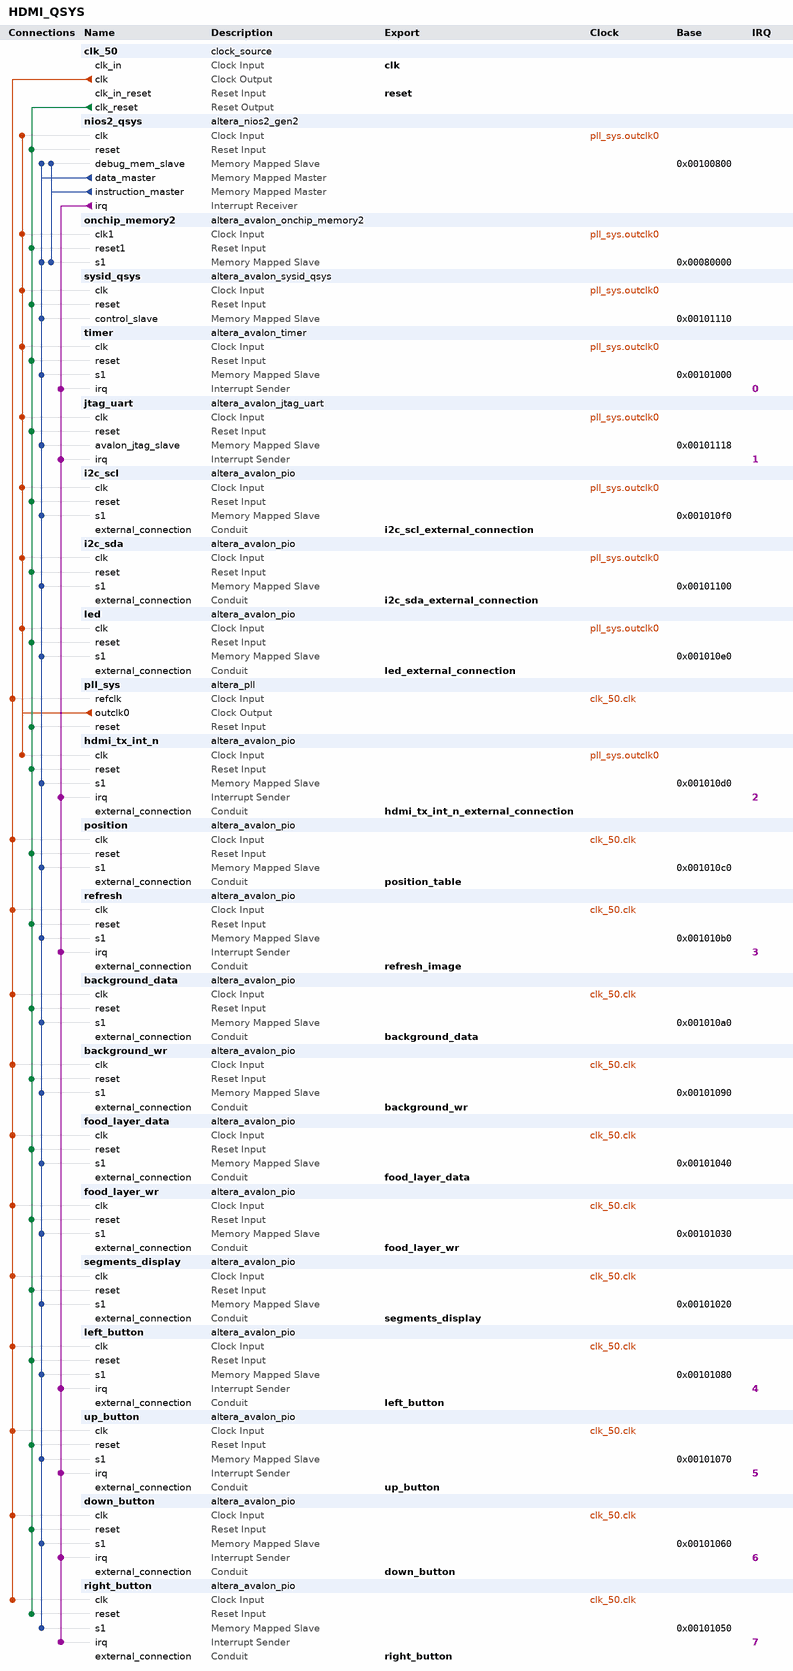
[diagram p0: system contents]
# Platform Designer (Qsys) system HDMI_QSYS, Cyclone V 5CGXFC5C6F27C7
# Parameters at their usual value, and those the tool derives, are not listed.
package require -exact qsys 18.0
create_system HDMI_QSYS
set_project_property DEVICE_FAMILY {Cyclone V}
set_project_property DEVICE 5CGXFC5C6F27C7

add_instance clk_50 clock_source 18.0
set_instance_parameter_value clk_50 clockFrequency 50000000

add_instance nios2_qsys altera_nios2_gen2 18.0
set_instance_parameter_value nios2_qsys dcache_size 2048
set_instance_parameter_value nios2_qsys exceptionSlave onchip_memory2.s1
set_instance_parameter_value nios2_qsys icache_size 4096
set_instance_parameter_value nios2_qsys impl Fast
set_instance_parameter_value nios2_qsys resetSlave onchip_memory2.s1
set_instance_parameter_value nios2_qsys setting_activateTrace true

add_instance onchip_memory2 altera_avalon_onchip_memory2 18.0
set_instance_parameter_value onchip_memory2 dataWidth 32
set_instance_parameter_value onchip_memory2 dualPort false
set_instance_parameter_value onchip_memory2 initMemContent true
set_instance_parameter_value onchip_memory2 initializationFileName onchip_memory2
set_instance_parameter_value onchip_memory2 memorySize 400000

add_instance sysid_qsys altera_avalon_sysid_qsys 18.0
set_instance_parameter_value sysid_qsys id 0

add_instance timer altera_avalon_timer 18.0
set_instance_parameter_value timer period 1
set_instance_parameter_value timer periodUnits MSEC

add_instance jtag_uart altera_avalon_jtag_uart 18.0
set_instance_parameter_value jtag_uart simInteractiveOptions INTERACTIVE_ASCII_OUTPUT

add_instance i2c_scl altera_avalon_pio 18.0
set_instance_parameter_value i2c_scl direction Output
set_instance_parameter_value i2c_scl resetValue 1
set_instance_parameter_value i2c_scl width 1

add_instance i2c_sda altera_avalon_pio 18.0
set_instance_parameter_value i2c_sda direction Bidir
set_instance_parameter_value i2c_sda resetValue 1
set_instance_parameter_value i2c_sda width 1

add_instance led altera_avalon_pio 18.0
set_instance_parameter_value led direction Output
set_instance_parameter_value led width 8

add_instance pll_sys altera_pll 18.0
set_instance_parameter_value pll_sys gui_device_speed_grade 2
set_instance_parameter_value pll_sys gui_number_of_clocks 1
set_instance_parameter_value pll_sys gui_operation_mode normal
set_instance_parameter_value pll_sys gui_output_clock_frequency0 50.0
set_instance_parameter_value pll_sys gui_pll_mode {Integer-N PLL}
set_instance_parameter_value pll_sys gui_reference_clock_frequency 50.0
set_instance_parameter_value pll_sys gui_use_locked true

add_instance hdmi_tx_int_n altera_avalon_pio 18.0
set_instance_parameter_value hdmi_tx_int_n bitClearingEdgeCapReg true
set_instance_parameter_value hdmi_tx_int_n captureEdge true
set_instance_parameter_value hdmi_tx_int_n direction Input
set_instance_parameter_value hdmi_tx_int_n edgeType FALLING
set_instance_parameter_value hdmi_tx_int_n generateIRQ true
set_instance_parameter_value hdmi_tx_int_n width 1

add_instance position altera_avalon_pio 18.0
set_instance_parameter_value position direction Output
set_instance_parameter_value position width 32

add_instance refresh altera_avalon_pio 18.0
set_instance_parameter_value refresh captureEdge true
set_instance_parameter_value refresh direction Input
set_instance_parameter_value refresh generateIRQ true
set_instance_parameter_value refresh irqType EDGE
set_instance_parameter_value refresh width 1

add_instance background_data altera_avalon_pio 18.0
set_instance_parameter_value background_data direction Output
set_instance_parameter_value background_data width 32

add_instance background_wr altera_avalon_pio 18.0
set_instance_parameter_value background_wr direction Output
set_instance_parameter_value background_wr width 5

add_instance food_layer_data altera_avalon_pio 18.0
set_instance_parameter_value food_layer_data direction Output
set_instance_parameter_value food_layer_data width 32

add_instance food_layer_wr altera_avalon_pio 18.0
set_instance_parameter_value food_layer_wr direction Output
set_instance_parameter_value food_layer_wr width 5

add_instance segments_display altera_avalon_pio 18.0
set_instance_parameter_value segments_display direction Output
set_instance_parameter_value segments_display width 21

add_instance left_button altera_avalon_pio 18.0
set_instance_parameter_value left_button captureEdge true
set_instance_parameter_value left_button direction Input
set_instance_parameter_value left_button edgeType FALLING
set_instance_parameter_value left_button generateIRQ true
set_instance_parameter_value left_button irqType EDGE
set_instance_parameter_value left_button width 1

add_instance up_button altera_avalon_pio 18.0
set_instance_parameter_value up_button captureEdge true
set_instance_parameter_value up_button direction Input
set_instance_parameter_value up_button edgeType FALLING
set_instance_parameter_value up_button generateIRQ true
set_instance_parameter_value up_button irqType EDGE
set_instance_parameter_value up_button width 1

add_instance down_button altera_avalon_pio 18.0
set_instance_parameter_value down_button captureEdge true
set_instance_parameter_value down_button direction Input
set_instance_parameter_value down_button edgeType FALLING
set_instance_parameter_value down_button generateIRQ true
set_instance_parameter_value down_button irqType EDGE
set_instance_parameter_value down_button width 1

add_instance right_button altera_avalon_pio 18.0
set_instance_parameter_value right_button captureEdge true
set_instance_parameter_value right_button direction Input
set_instance_parameter_value right_button edgeType FALLING
set_instance_parameter_value right_button generateIRQ true
set_instance_parameter_value right_button irqType EDGE
set_instance_parameter_value right_button width 1

# connections
add_connection clk_50.clk background_data.clk clock
add_connection clk_50.clk background_wr.clk clock
add_connection clk_50.clk down_button.clk clock
add_connection clk_50.clk food_layer_data.clk clock
add_connection clk_50.clk food_layer_wr.clk clock
add_connection clk_50.clk left_button.clk clock
add_connection clk_50.clk pll_sys.refclk clock
add_connection clk_50.clk position.clk clock
add_connection clk_50.clk refresh.clk clock
add_connection clk_50.clk right_button.clk clock
add_connection clk_50.clk segments_display.clk clock
add_connection clk_50.clk up_button.clk clock
add_connection pll_sys.outclk0 hdmi_tx_int_n.clk clock
add_connection pll_sys.outclk0 i2c_scl.clk clock
add_connection pll_sys.outclk0 i2c_sda.clk clock
add_connection pll_sys.outclk0 jtag_uart.clk clock
add_connection pll_sys.outclk0 led.clk clock
add_connection pll_sys.outclk0 nios2_qsys.clk clock
add_connection pll_sys.outclk0 onchip_memory2.clk1 clock
add_connection pll_sys.outclk0 sysid_qsys.clk clock
add_connection pll_sys.outclk0 timer.clk clock
add_connection clk_50.clk_reset background_data.reset reset
add_connection clk_50.clk_reset background_wr.reset reset
add_connection clk_50.clk_reset down_button.reset reset
add_connection clk_50.clk_reset food_layer_data.reset reset
add_connection clk_50.clk_reset food_layer_wr.reset reset
add_connection clk_50.clk_reset hdmi_tx_int_n.reset reset
add_connection clk_50.clk_reset i2c_scl.reset reset
add_connection clk_50.clk_reset i2c_sda.reset reset
add_connection clk_50.clk_reset jtag_uart.reset reset
add_connection clk_50.clk_reset led.reset reset
add_connection clk_50.clk_reset left_button.reset reset
add_connection clk_50.clk_reset nios2_qsys.reset reset
add_connection clk_50.clk_reset onchip_memory2.reset1 reset
add_connection clk_50.clk_reset pll_sys.reset reset
add_connection clk_50.clk_reset position.reset reset
add_connection clk_50.clk_reset refresh.reset reset
add_connection clk_50.clk_reset right_button.reset reset
add_connection clk_50.clk_reset segments_display.reset reset
add_connection clk_50.clk_reset sysid_qsys.reset reset
add_connection clk_50.clk_reset timer.reset reset
add_connection clk_50.clk_reset up_button.reset reset
add_connection nios2_qsys.data_master background_data.s1 avalon
set_connection_parameter_value nios2_qsys.data_master/background_data.s1 baseAddress 0x001010a0
add_connection nios2_qsys.data_master background_wr.s1 avalon
set_connection_parameter_value nios2_qsys.data_master/background_wr.s1 baseAddress 0x00101090
add_connection nios2_qsys.data_master down_button.s1 avalon
set_connection_parameter_value nios2_qsys.data_master/down_button.s1 baseAddress 0x00101060
add_connection nios2_qsys.data_master food_layer_data.s1 avalon
set_connection_parameter_value nios2_qsys.data_master/food_layer_data.s1 baseAddress 0x00101040
add_connection nios2_qsys.data_master food_layer_wr.s1 avalon
set_connection_parameter_value nios2_qsys.data_master/food_layer_wr.s1 baseAddress 0x00101030
add_connection nios2_qsys.data_master hdmi_tx_int_n.s1 avalon
set_connection_parameter_value nios2_qsys.data_master/hdmi_tx_int_n.s1 baseAddress 0x001010d0
add_connection nios2_qsys.data_master i2c_scl.s1 avalon
set_connection_parameter_value nios2_qsys.data_master/i2c_scl.s1 baseAddress 0x001010f0
add_connection nios2_qsys.data_master i2c_sda.s1 avalon
set_connection_parameter_value nios2_qsys.data_master/i2c_sda.s1 baseAddress 0x00101100
add_connection nios2_qsys.data_master jtag_uart.avalon_jtag_slave avalon
set_connection_parameter_value nios2_qsys.data_master/jtag_uart.avalon_jtag_slave baseAddress 0x00101118
add_connection nios2_qsys.data_master led.s1 avalon
set_connection_parameter_value nios2_qsys.data_master/led.s1 baseAddress 0x001010e0
add_connection nios2_qsys.data_master left_button.s1 avalon
set_connection_parameter_value nios2_qsys.data_master/left_button.s1 baseAddress 0x00101080
add_connection nios2_qsys.data_master nios2_qsys.debug_mem_slave avalon
set_connection_parameter_value nios2_qsys.data_master/nios2_qsys.debug_mem_slave baseAddress 0x00100800
add_connection nios2_qsys.data_master onchip_memory2.s1 avalon
set_connection_parameter_value nios2_qsys.data_master/onchip_memory2.s1 baseAddress 0x00080000
add_connection nios2_qsys.data_master position.s1 avalon
set_connection_parameter_value nios2_qsys.data_master/position.s1 baseAddress 0x001010c0
add_connection nios2_qsys.data_master refresh.s1 avalon
set_connection_parameter_value nios2_qsys.data_master/refresh.s1 baseAddress 0x001010b0
add_connection nios2_qsys.data_master right_button.s1 avalon
set_connection_parameter_value nios2_qsys.data_master/right_button.s1 baseAddress 0x00101050
add_connection nios2_qsys.data_master segments_display.s1 avalon
set_connection_parameter_value nios2_qsys.data_master/segments_display.s1 baseAddress 0x00101020
add_connection nios2_qsys.data_master sysid_qsys.control_slave avalon
set_connection_parameter_value nios2_qsys.data_master/sysid_qsys.control_slave baseAddress 0x00101110
add_connection nios2_qsys.data_master timer.s1 avalon
set_connection_parameter_value nios2_qsys.data_master/timer.s1 baseAddress 0x00101000
add_connection nios2_qsys.data_master up_button.s1 avalon
set_connection_parameter_value nios2_qsys.data_master/up_button.s1 baseAddress 0x00101070
add_connection nios2_qsys.instruction_master nios2_qsys.debug_mem_slave avalon
set_connection_parameter_value nios2_qsys.instruction_master/nios2_qsys.debug_mem_slave baseAddress 0x00100800
add_connection nios2_qsys.instruction_master onchip_memory2.s1 avalon
set_connection_parameter_value nios2_qsys.instruction_master/onchip_memory2.s1 baseAddress 0x00080000
add_connection nios2_qsys.irq down_button.irq interrupt
set_connection_parameter_value nios2_qsys.irq/down_button.irq irqNumber 6
add_connection nios2_qsys.irq hdmi_tx_int_n.irq interrupt
set_connection_parameter_value nios2_qsys.irq/hdmi_tx_int_n.irq irqNumber 2
add_connection nios2_qsys.irq jtag_uart.irq interrupt
set_connection_parameter_value nios2_qsys.irq/jtag_uart.irq irqNumber 1
add_connection nios2_qsys.irq left_button.irq interrupt
set_connection_parameter_value nios2_qsys.irq/left_button.irq irqNumber 4
add_connection nios2_qsys.irq refresh.irq interrupt
set_connection_parameter_value nios2_qsys.irq/refresh.irq irqNumber 3
add_connection nios2_qsys.irq right_button.irq interrupt
set_connection_parameter_value nios2_qsys.irq/right_button.irq irqNumber 7
add_connection nios2_qsys.irq timer.irq interrupt
set_connection_parameter_value nios2_qsys.irq/timer.irq irqNumber 0
add_connection nios2_qsys.irq up_button.irq interrupt
set_connection_parameter_value nios2_qsys.irq/up_button.irq irqNumber 5

# exported interfaces
add_interface background_data conduit end
set_interface_property background_data EXPORT_OF background_data.external_connection
add_interface background_wr conduit end
set_interface_property background_wr EXPORT_OF background_wr.external_connection
add_interface clk clock sink
set_interface_property clk EXPORT_OF clk_50.clk_in
add_interface down_button conduit end
set_interface_property down_button EXPORT_OF down_button.external_connection
add_interface food_layer_data conduit end
set_interface_property food_layer_data EXPORT_OF food_layer_data.external_connection
add_interface food_layer_wr conduit end
set_interface_property food_layer_wr EXPORT_OF food_layer_wr.external_connection
add_interface hdmi_tx_int_n_external_connection conduit end
set_interface_property hdmi_tx_int_n_external_connection EXPORT_OF hdmi_tx_int_n.external_connection
add_interface i2c_scl_external_connection conduit end
set_interface_property i2c_scl_external_connection EXPORT_OF i2c_scl.external_connection
add_interface i2c_sda_external_connection conduit end
set_interface_property i2c_sda_external_connection EXPORT_OF i2c_sda.external_connection
add_interface led_external_connection conduit end
set_interface_property led_external_connection EXPORT_OF led.external_connection
add_interface left_button conduit end
set_interface_property left_button EXPORT_OF left_button.external_connection
add_interface position_table conduit end
set_interface_property position_table EXPORT_OF position.external_connection
add_interface refresh_image conduit end
set_interface_property refresh_image EXPORT_OF refresh.external_connection
add_interface reset reset sink
set_interface_property reset EXPORT_OF clk_50.clk_in_reset
add_interface right_button conduit end
set_interface_property right_button EXPORT_OF right_button.external_connection
add_interface segments_display conduit end
set_interface_property segments_display EXPORT_OF segments_display.external_connection
add_interface up_button conduit end
set_interface_property up_button EXPORT_OF up_button.external_connection

set_interconnect_requirement {$system} qsys_mm.clockCrossingAdapter HANDSHAKE
set_interconnect_requirement {$system} qsys_mm.maxAdditionalLatency 1

save_system HDMI_QSYS.qsys
